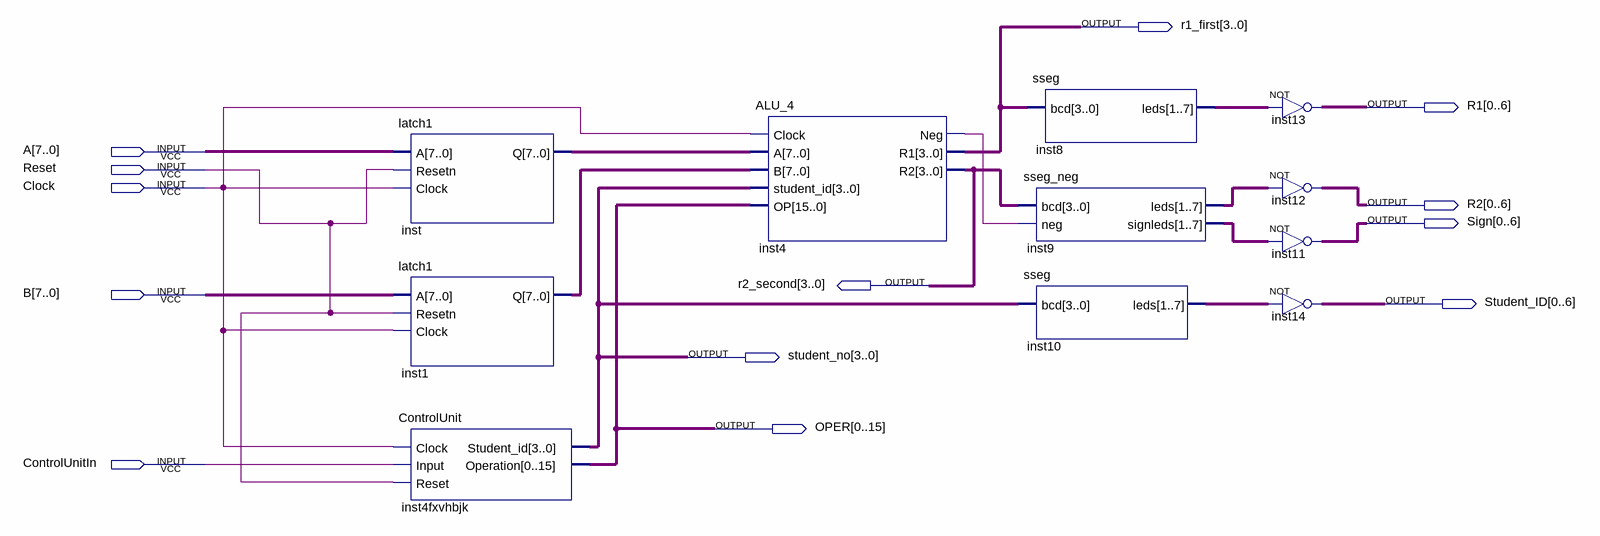
[diagram p0: schematic sheet]
// Quartus schematic FinalDesign.bdf as structural Verilog: 11 symbols, 13 pins
module FinalDesign (
  input  [7:0] A,
  input  Reset,
  input  Clock,
  input  [7:0] B,
  input  ControlUnitIn,
  output [3:0] r1_first,
  output [0:6] R1,
  output [0:6] R2,
  output [0:6] Sign,
  output [3:0] r2_second,
  output [0:6] Student_ID,
  output [3:0] student_no,
  output [0:15] OPER
);

  wire inst4_neg;
  wire [6:0] inst8_leds, inst9_leds, inst9_signleds, inst10_leds;
  wire [7:0] inst1_q, inst_q;

  latch1 inst (.A(A), .Resetn(Reset), .Clock(Clock), .Q(inst_q));
  latch1 inst1 (.A(B), .Resetn(Reset), .Clock(Clock), .Q(inst1_q));
  ControlUnit inst4fxvhbjk (
    .Clock(Clock), .Input(ControlUnitIn), .Reset(Reset), .Student_id(student_no), .Operation(OPER));
  ALU_4 inst4 (
    .Clock(Clock), .A(inst_q), .B(inst1_q), .student_id(student_no), .OP(OPER), .Neg(inst4_neg),
    .R1(r1_first), .R2(r2_second));
  sseg inst8 (.bcd(r1_first), .leds(inst8_leds));
  sseg_neg inst9 (.bcd(r2_second), .neg(inst4_neg), .leds(inst9_leds), .signleds(inst9_signleds));
  sseg inst10 (.bcd(student_no), .leds(inst10_leds));
  assign R1 = ~inst8_leds;  // NOT inst13, 7 bits wide
  assign R2 = ~inst9_leds;  // NOT inst12, 7 bits wide
  assign Sign = ~inst9_signleds;  // NOT inst11, 7 bits wide
  assign Student_ID = ~inst10_leds;  // NOT inst14, 7 bits wide
endmodule
